# EAGLE design batt (EAGLE 9.6.0)
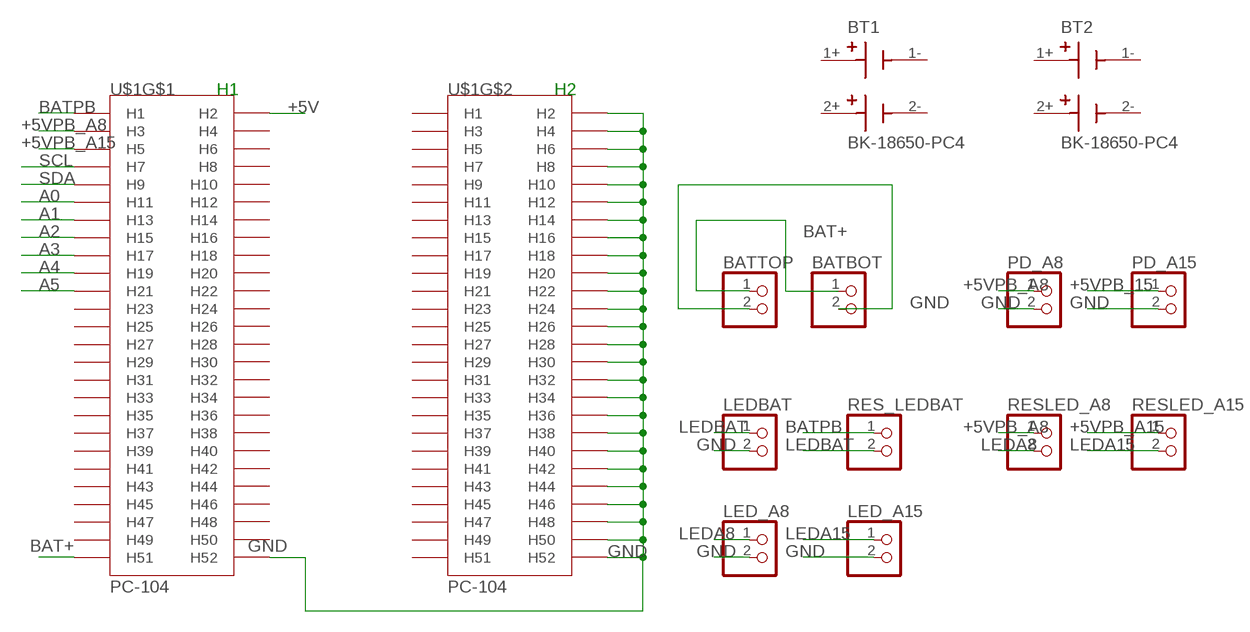
[diagram p0: schematic, sheet 1]

## Parts
BATBOT  PINHD-1X2  [1X02]
BATTOP  PINHD-1X2  [1X02]
BT1  BK-18650-PC4  [BAT_BK-18650-PC4]
BT2  BK-18650-PC4  [BAT_BK-18650-PC4]
LED_A8  PINHD-1X2  [1X02]
LED_A15  PINHD-1X2  [1X02]
LEDBAT  PINHD-1X2  [1X02]
PD_A8  PINHD-1X2  [1X02]
PD_A15  PINHD-1X2  [1X02]
RES_LEDBAT  PINHD-1X2  [1X02]
RESLED_A8  PINHD-1X2  [1X02]
RESLED_A15  PINHD-1X2  [1X02]
U$1  PC-104  [PC-104]

## Nets
+5V: U$1.P$2(H2)
+5VPB_15: PD_A15.1
+5VPB_A8: PD_A8.1 RESLED_A8.1 U$1.P$3(H3)
+5VPB_A15: RESLED_A15.1 U$1.P$5(H5)
A0: U$1.P$11(H11)
A1: U$1.P$13(H13)
A2: U$1.P$15(H15)
A3: U$1.P$17(H17)
A4: U$1.P$19(H19)
A5: U$1.P$21(H21)
BAT+: BATBOT.1 BATTOP.1 U$1.P$51(H51)
BATPB: RES_LEDBAT.1 U$1.P$1(H1)
GND [GND]: BATBOT.2 BATTOP.2 LED_A8.2 LED_A15.2 LEDBAT.2 PD_A8.2 PD_A15.2 U$1.P$52(H52) U$1.P$54(H2) U$1.P$56(H4) U$1.P$58(H6) U$1.P$60(H8) U$1.P$62(H10) U$1.P$64(H12) U$1.P$66(H14) U$1.P$68(H16) U$1.P$70(H18) U$1.P$72(H20) U$1.P$74(H22) U$1.P$76(H24) U$1.P$78(H26) U$1.P$80(H28) U$1.P$82(H30) U$1.P$84(H32) U$1.P$86(H34) U$1.P$88(H36) U$1.P$90(H38) U$1.P$92(H40) U$1.P$94(H42) U$1.P$96(H44) U$1.P$98(H46) U$1.P$100(H48) U$1.P$102(H50) U$1.P$104(H52)
LEDA8 [GND]: LED_A8.1 RESLED_A8.2
LEDA15: LED_A15.1 RESLED_A15.2
LEDBAT: LEDBAT.1 RES_LEDBAT.2
SCL: U$1.P$7(H7)
SDA: U$1.P$9(H9)
Unconnected: BT1.1+ BT1.1- BT1.2+ BT1.2- BT2.1+ BT2.1- BT2.2+ BT2.2- U$1.P$4(H4) U$1.P$6(H6) U$1.P$8(H8) U$1.P$10(H10) U$1.P$12(H12) U$1.P$14(H14) U$1.P$16(H16) U$1.P$18(H18) U$1.P$20(H20) U$1.P$22(H22) U$1.P$23(H23) U$1.P$24(H24) U$1.P$25(H25) U$1.P$26(H26) U$1.P$27(H27) U$1.P$28(H28) U$1.P$29(H29) U$1.P$30(H30) U$1.P$31(H31) U$1.P$32(H32) U$1.P$33(H33) U$1.P$34(H34) U$1.P$35(H35) U$1.P$36(H36) U$1.P$37(H37) U$1.P$38(H38) U$1.P$39(H39) U$1.P$40(H40) U$1.P$41(H41) U$1.P$42(H42) U$1.P$43(H43) U$1.P$44(H44) U$1.P$45(H45) U$1.P$46(H46) U$1.P$47(H47) U$1.P$48(H48) U$1.P$49(H49) U$1.P$50(H50) U$1.P$53(H1) U$1.P$55(H3) U$1.P$57(H5) U$1.P$59(H7) U$1.P$61(H9) U$1.P$63(H11) U$1.P$65(H13) U$1.P$67(H15) U$1.P$69(H17) U$1.P$71(H19) U$1.P$73(H21) U$1.P$75(H23) U$1.P$77(H25) U$1.P$79(H27) U$1.P$81(H29) U$1.P$83(H31) U$1.P$85(H33) U$1.P$87(H35) U$1.P$89(H37) U$1.P$91(H39) U$1.P$93(H41) U$1.P$95(H43) U$1.P$97(H45) U$1.P$99(H47) U$1.P$101(H49) U$1.P$103(H51)

## Notes on the sheet
- H1 | H2

## Library data of the parts
BATBOT BATTOP LED_A8 LED_A15 LEDBAT PD_A8 PD_A15 RES_LEDBAT RESLED_A8 RESLED_A15 = pinhead:PINHD-1X2: PIN HEADER
BT1 BT2 = BK-18650-PC4:BK-18650-PC4: Battery Holder (Open) 18650 2 Cell PC Pin Check availability <https://pricing.snapeda.com/parts/BK-18650-PC4/MPD/view-part?ref=eda>; AVAILABILITY: In Stock; DESCRIPTION: Battery Holder (Open) 18650 2 Cell PC Pin; MF: MPD; MP: BK-18650-PC4; PACKAGE: None; PRICE: None; PURCHASE-URL: https://pricing.snapeda.com/search/part/BK-18650-PC4/?ref=eda
U$1 = Locana Board:PC-104

## Net classes
0 default: width 0.203 mm
1 GND: width 0.254 mm

## Board
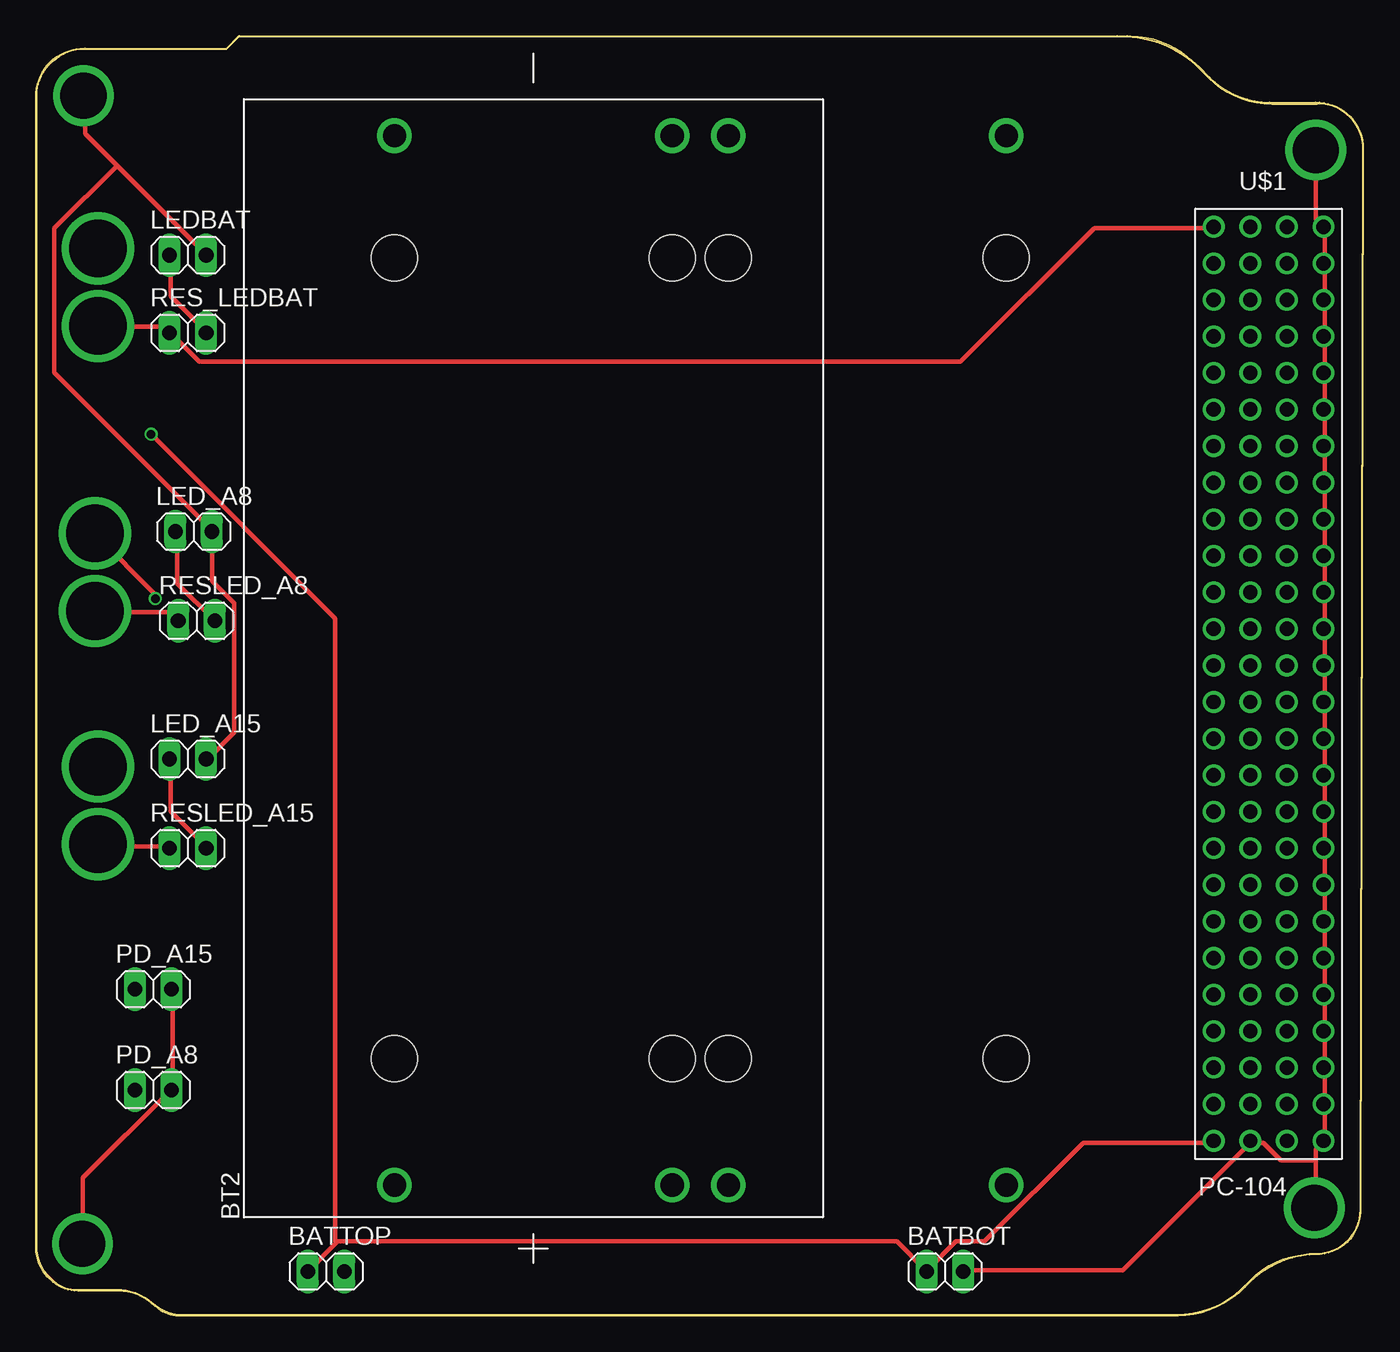
[diagram p1: board, top side]
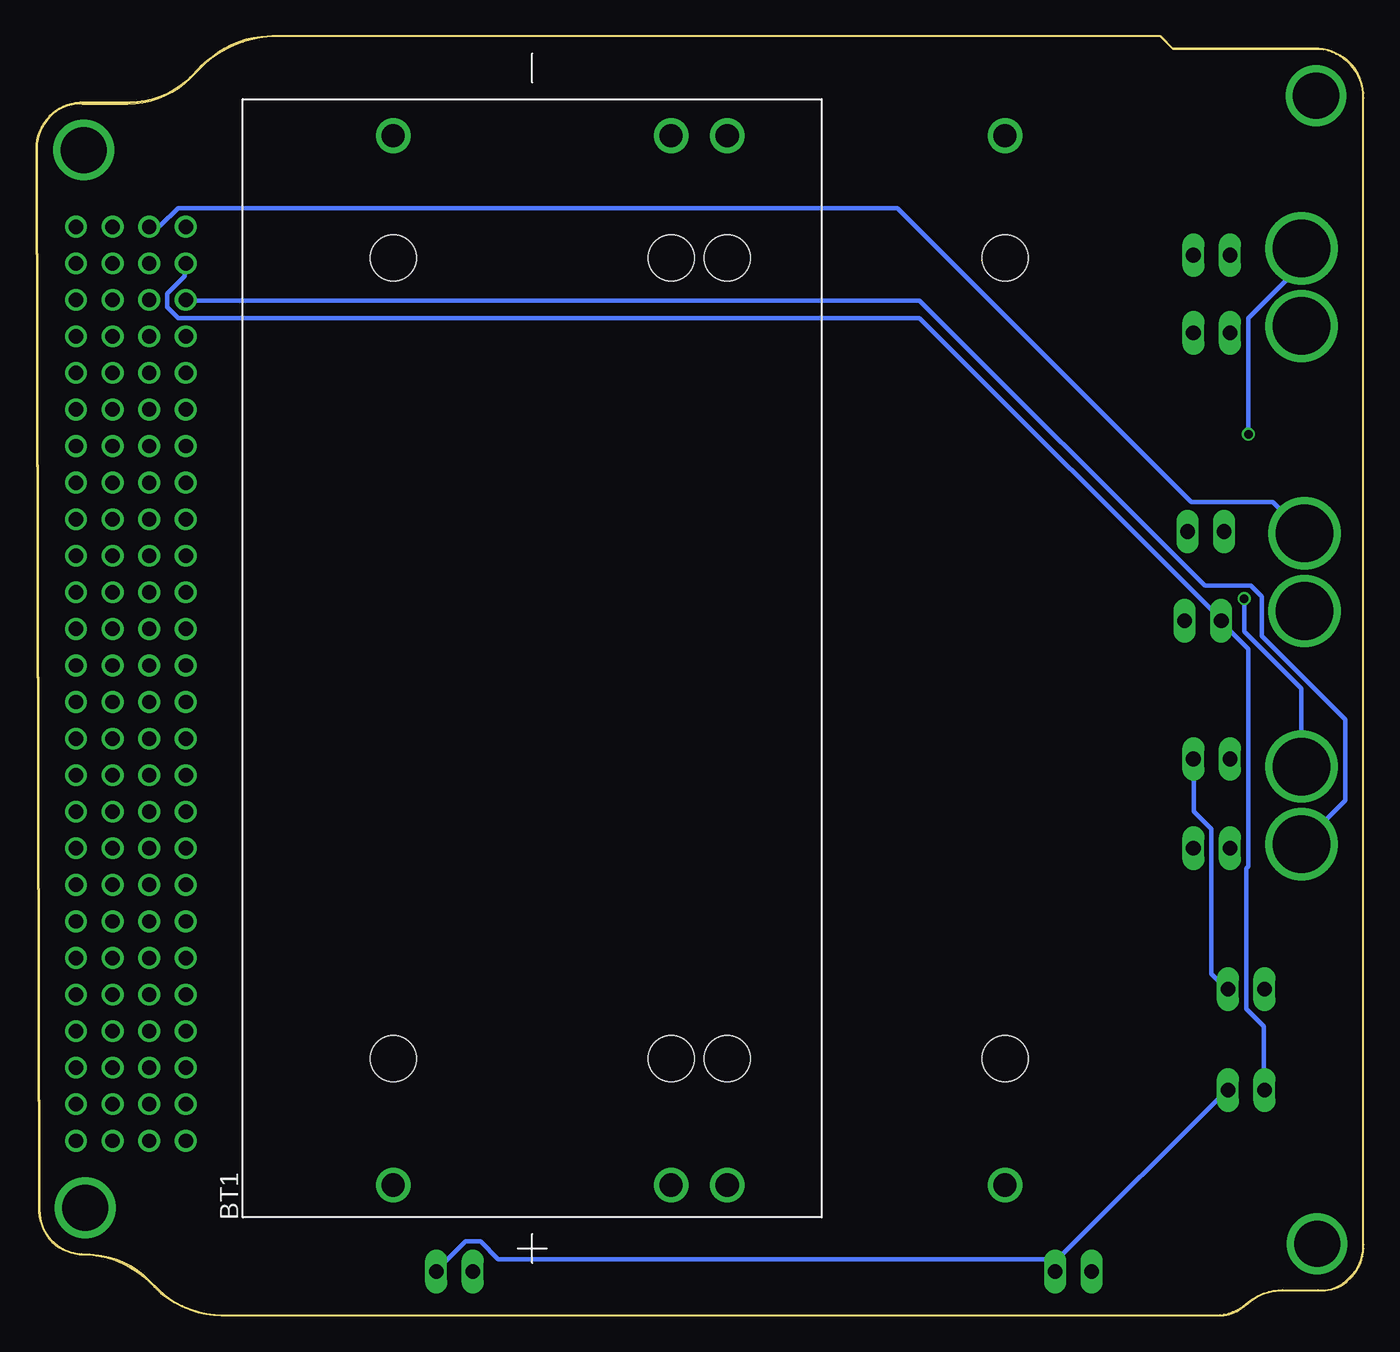
[diagram p2: board, bottom side, seen from below]

Size 92.22 x 88.9 mm. Coordinates in mm from the lower left corner, seen from the top.
Outline: 89.1,84.2 arc-90 92.22,81.05 92.02,7.52 arc-90 89,4.28 88.71,4.28 arc45 84.38,2.48 83.69,1.8 arc-45 79.36,0 9.88,0 arc-40 8.51,0.5 8.37,0.63 arc45 5.71,1.73 3.2,1.73 arc-90 0.05,4.83 0.05,84.83 arc-90 3.17,88 13.22,88 14.1,88.87 76.06,88.87 arc-45 80.39,87.08 81.5,85.97 arc45 85.84,84.18 89.02,84.18
Outline: 0,4.93 0,84.61 arc-90 3.41,88.03 13.25,88.03 14.12,88.9 75.11,88.9 arc-45 80.81,86.72 81.52,86.01 arc45 85.7,84.28 88.88,84.28 arc-90 92.17,81.13 92,7.66 arc-45 91.1,5.13 arc-35 89.21,4.28 89.05,4.28 arc45 84.27,2.3 83.98,2.01 arc-45 79.2,0.03 10.28,0.03 arc-41 8.04,0.87 arc41 5.62,1.78 3.15,1.78 arc-45 1.18,2.34 0.82,2.71 arc-45 0,4.93
Copper layers (1*16): Top 0.035mm / dielectric 1.5mm / Bottom 0.035mm
Design rules "default *": minimum track width 12mil, minimum drill 0.6mm, track to track 12mil, track to pad 12mil, pad to pad 12mil, via to via 12mil, smd to smd 12mil, copper to edge 40mil, drill to drill 12mil, minimum pad ring 10mil, minimum via ring 6mil, stop-mask expansion 4mil, vias tented up to drill 0mil, thermal gap 10mil

### Footprints (pad centres in the part's own frame; a part is rotated, then mirrored left to right if it is on the bottom)
1X02 = drill 1.016 long: 1 -1.27,0; 2 1.27,0
BAT_BK-18650-PC4 = drill 1.6: 1+ -36.6,9.65; 1- 36.3,9.65; 2+ -36.6,-9.65; 2- 36.3,-9.65 | hole 3.2: -27.81,-9.65; -27.81,9.65; 27.81,-9.65; 27.81,9.65
PC-104 = drill 1: P$1 -3.81,31.75; P$2 -1.27,31.75; P$3 -3.81,29.21; P$4 -1.27,29.21; P$5 -3.81,26.67; P$6 -1.27,26.67; P$7 -3.81,24.13; P$8 -1.27,24.13; P$9 -3.81,21.59; P$10 -1.27,21.59; P$11 -3.81,19.05; P$12 -1.27,19.05; P$13 -3.81,16.51; P$14 -1.27,16.51; P$15 -3.81,13.97; P$16 -1.27,13.97; P$17 -3.81,11.43; P$18 -1.27,11.43; P$19 -3.81,8.89; P$20 -1.27,8.89; P$21 -3.81,6.35; P$22 -1.27,6.35; P$23 -3.81,3.81; P$24 -1.27,3.81; P$25 -3.81,1.27; P$26 -1.27,1.27; P$27 -3.81,-1.27; P$28 -1.27,-1.27; P$29 -3.81,-3.81; P$30 -1.27,-3.81; P$31 -3.81,-6.35; P$32 -1.27,-6.35; P$33 -3.81,-8.89; P$34 -1.27,-8.89; P$35 -3.81,-11.43; P$36 -1.27,-11.43; P$37 -3.81,-13.97; P$38 -1.27,-13.97; P$39 -3.81,-16.51; P$40 -1.27,-16.51; P$41 -3.81,-19.05; P$42 -1.27,-19.05; P$43 -3.81,-21.59; P$44 -1.27,-21.59; P$45 -3.81,-24.13; P$46 -1.27,-24.13; P$47 -3.81,-26.67; P$48 -1.27,-26.67; P$49 -3.81,-29.21; P$50 -1.27,-29.21; P$51 -3.81,-31.75; P$52 -1.27,-31.75; P$53 1.27,31.75; P$54 3.81,31.75; P$55 1.27,29.21; P$56 3.81,29.21; P$57 1.27,26.67; P$58 3.81,26.67; P$59 1.27,24.13; P$60 3.81,24.13; P$61 1.27,21.59; P$62 3.81,21.59; P$63 1.27,19.05; P$64 3.81,19.05; P$65 1.27,16.51; P$66 3.81,16.51; P$67 1.27,13.97; P$68 3.81,13.97; P$69 1.27,11.43; P$70 3.81,11.43; P$71 1.27,8.89; P$72 3.81,8.89; P$73 1.27,6.35; P$74 3.81,6.35; P$75 1.27,3.81; P$76 3.81,3.81; P$77 1.27,1.27; P$78 3.81,1.27; P$79 1.27,-1.27; P$80 3.81,-1.27; P$81 1.27,-3.81; P$82 3.81,-3.81; P$83 1.27,-6.35; P$84 3.81,-6.35; P$85 1.27,-8.89; P$86 3.81,-8.89; P$87 1.27,-11.43; P$88 3.81,-11.43; P$89 1.27,-13.97; P$90 3.81,-13.97; P$91 1.27,-16.51; P$92 3.81,-16.51; P$93 1.27,-19.05; P$94 3.81,-19.05; P$95 1.27,-21.59; P$96 3.81,-21.59; P$97 1.27,-24.13; P$98 3.81,-24.13; P$99 1.27,-26.67; P$100 3.81,-26.67; P$101 1.27,-29.21; P$102 3.81,-29.21; P$103 1.27,-31.75; P$104 3.81,-31.75

### Placement (x,y rotation side)
BATBOT  63.15,3.08 0 top
BATTOP  20.15,3.08 0 top
BT1  57.75,45.68 90 bottom
BT2  34.55,45.68 90 top
LED_A8  10.95,54.48 0 top
LED_A15  10.55,38.68 0 top
LEDBAT  10.55,73.68 0 top
PD_A8  8.15,15.68 0 top
PD_A15  8.15,22.68 0 top
RES_LEDBAT  10.55,68.28 0 top
RESLED_A8  11.15,48.28 0 top
RESLED_A15  10.55,32.48 0 top
U$1  85.62,43.9 0 top

### Tracks (layer width: path | path; a pad name or v marks a point on that pad's centre or on a via)
+5V  (via drill 0.6, 4)
  Top 0.305: v8.29,49.81 8.29,50.11 4.18,54.23 v4.1,54.35
  Bottom 0.305: U$1.P$2 84.34,75.72 83.58,75.72 82.36,76.94 32.37,76.94 11.95,56.51 6.31,56.51 4.18,54.38 v4.1,54.35 | v8.29,49.81 8.29,47.52 4.33,43.56 4.33,38.23 v4.3,38.15
+5VPB_A8  (via drill 4)
  Top 0.305: v4.1,48.95 4.18,48.89 9.21,48.89 9.82,48.28 RESLED_A8.1
  Bottom 0.305: U$1.P$3 81.9,72.97 81.9,72.21 83.12,70.99 83.12,70.08 82.36,69.32 30.85,69.32 9.82,48.28 RESLED_A8.1 9.82,48.13 7.99,46.3 7.99,31.22 8.14,31.06 8.14,21.31 6.92,20.09 6.92,15.82 PD_A8.1
+5VPB_A15  (via drill 4)
  Top 0.305: RESLED_A15.1 9.21,32.59 4.48,32.59 4.33,32.74 v4.3,32.75
  Bottom 0.305: U$1.P$5 81.75,70.53 30.85,70.53 11.04,50.72 7.84,50.72 7.07,49.96 7.07,47.22 1.28,41.43 1.28,35.79 4.18,32.89 v4.3,32.75
BAT+  (via drill 0.6, 4)
  Top 0.305: U$1.P$51 81.75,12.01 72.76,12.01 65.9,5.16 63.92,5.16 61.94,3.17 BATBOT.1 61.78,3.17 59.8,5.16 20.94,5.16 20.87,5.08 | 20.87,5.08 18.96,3.17 BATTOP.1 | v7.99,61.24 20.79,48.44 20.79,5.16 20.87,5.08
  Bottom 0.305: v7.99,61.24 7.99,69.32 4.33,72.97 4.33,74.04 v4.3,74.15
BATPB  (via drill 4)
  Top 0.305: U$1.P$1 81.75,75.56 73.52,75.56 64.22,66.27 11.34,66.27 9.36,68.25 RES_LEDBAT.1 9.21,68.4 8.9,68.71 4.33,68.71 v4.3,68.75
GND  (via drill 3.2)
  Top 0.305: 5.63,79.91 11.8,73.74 LEDBAT.2 | 5.63,79.91 3.42,82.12 3.42,84.71 v3.3,84.75 | v3.22,5 3.26,5.16 3.26,9.57 9.36,15.67 PD_A8.2 9.51,15.82 9.51,22.53 PD_A15.2 | LED_A15.2 11.95,38.68 13.78,40.51 13.78,49.5 12.25,51.03 12.25,54.38 LED_A8.2 12.25,54.53 1.28,65.51 1.28,75.56 5.63,79.91 | v88.9,80.98 88.91,80.9 88.91,76.17 89.37,75.72 U$1.P$54 89.52,75.56 89.52,73.13 U$1.P$56 89.52,72.97 89.52,70.69 U$1.P$58 89.52,70.53 89.52,68.1 U$1.P$60 89.52,67.94 89.52,65.51 U$1.P$62 89.52,65.35 89.52,63.07 U$1.P$64 89.52,62.91 89.52,60.48 U$1.P$66 89.52,60.32 89.52,57.89 U$1.P$68 89.52,57.73 89.52,55.45 U$1.P$70 89.52,55.29 89.52,52.86 U$1.P$72 89.52,52.7 89.52,50.27 U$1.P$74 89.52,50.11 89.52,47.83 U$1.P$76 89.52,47.67 89.52,45.24 U$1.P$78 89.52,45.08 89.52,42.65 U$1.P$80 89.52,42.49 89.52,40.21 U$1.P$82 89.52,40.05 89.52,37.62 U$1.P$84 89.52,37.46 89.52,35.03 U$1.P$86 89.52,34.87 89.52,32.59 U$1.P$88 89.52,32.43 89.52,30 U$1.P$90 89.52,29.84 89.52,27.41 U$1.P$92 89.52,27.25 89.52,24.97 U$1.P$94 89.52,24.81 89.52,22.38 U$1.P$96 89.52,22.22 89.52,19.79 U$1.P$98 89.52,19.63 89.52,17.35 U$1.P$100 89.52,17.19 89.52,14.76 U$1.P$102 89.52,14.6 89.52,12.17 U$1.P$104 89.37,12.01 88.91,11.56 88.91,10.79 | 88.91,10.79 88.91,7.59 v88.8,7.5 | 88.91,10.79 86.47,10.79 85.25,12.01 84.49,12.01 U$1.P$52 84.34,12.01 75.5,3.17 64.53,3.17 BATBOT.2
  Bottom 0.305: PD_A8.2 9.51,15.67 21.4,3.78 21.4,3.17 BATTOP.2 21.4,3.94 60.11,3.94 61.33,5.16 62.4,5.16 64.38,3.17 BATBOT.2 | LED_A15.2 11.8,38.53 11.8,35.03 10.58,33.81 10.58,23.75 9.51,22.68 PD_A15.2
LEDA8
  Top 0.305: LED_A8.1 9.82,54.38 9.82,50.88 12.41,48.28 RESLED_A8.2
LEDA15
  Top 0.305: LED_A15.1 9.36,38.53 9.36,35.03 11.8,32.59 RESLED_A15.2
LEDBAT
  Top 0.305: LEDBAT.1 9.36,73.58 9.36,70.84 11.8,68.4 RES_LEDBAT.2

### Text on the board
bTest: VBAT | 5V | SCL | 3.3V | SDA | CAN_HIGH | 5V | GND | 3.3v | SDA | GND | CAN_HIGH | CAN_LOW | GND | SDL | CAN_LOW | 5V
Name: LOCANA + ICU BOARD